# EAGLE design Sch (EAGLE 7.5.0)
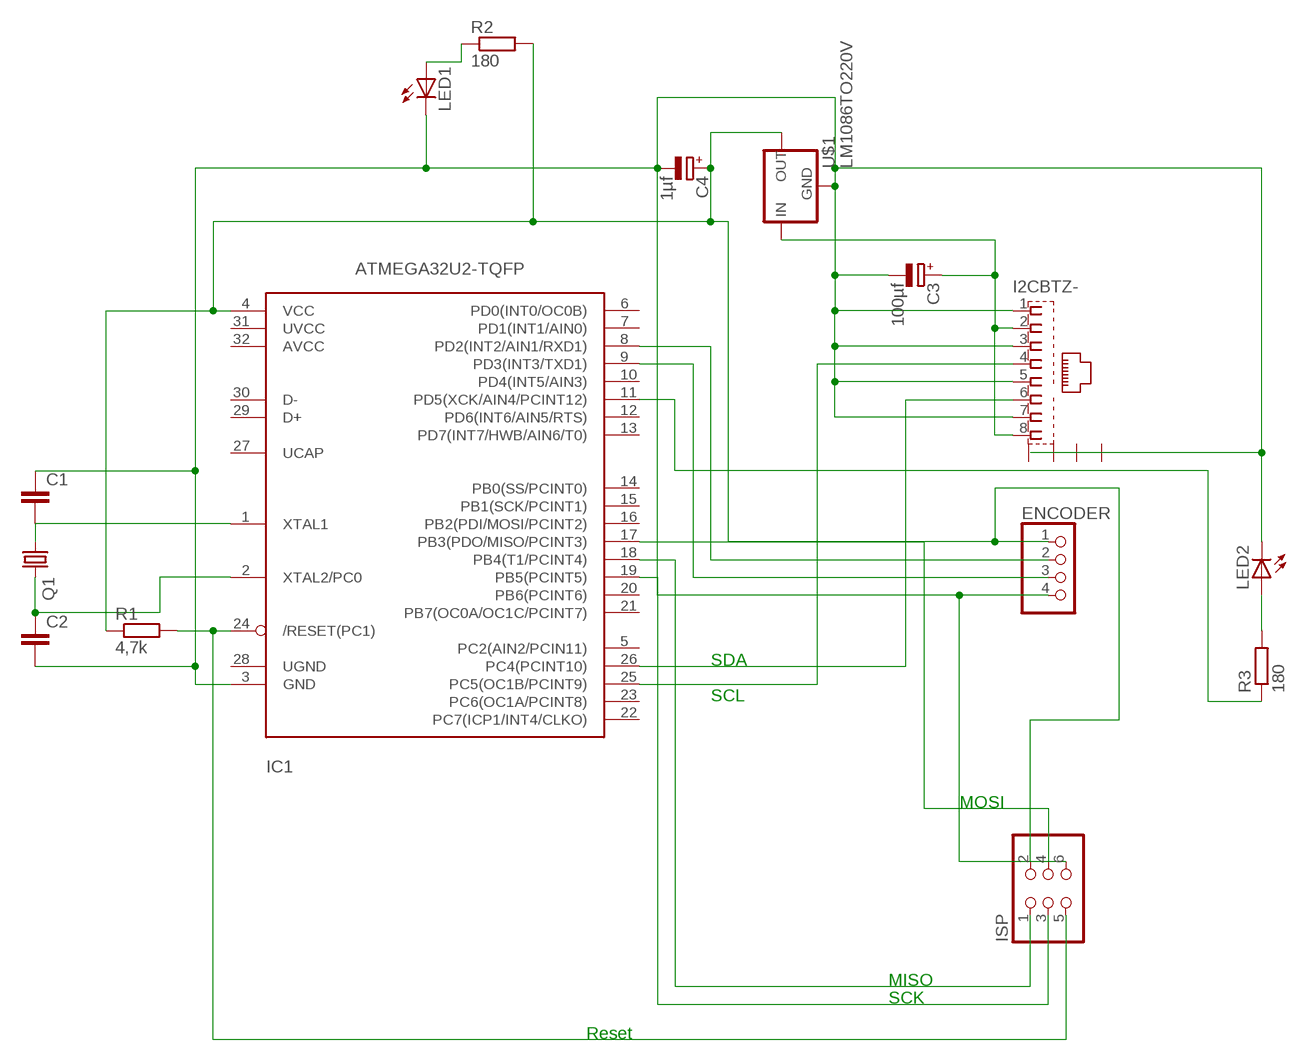
[diagram p0: schematic, sheet 1]

## Parts
C1  C-EU025-025X050  [C025-025X050]
C2  C-EU025-025X050  [C025-025X050]
C3  100µf  CPOL-EUE2.5-6  [E2,5-6]
C4  1µf  CPOL-EUE2.5-6  [E2,5-6]
ENCODER  PINHD-1X4  [1X04]
I2CBTZ  RJ45  [RJ45]
IC1  ATMEGA32U2-TQFP  [TQFP32-08]
ISP  PINHD-2X3  [2X03]
LED1  LED5MM  [LED5MM]
LED2  LED5MM  [LED5MM]
Q1  CRYSTALHC49S  [HC49/S]
R1  4,7k  R-EU_0204/7  [0204/7]
R2  180  R-EU_0204/7  [0204/7]
R3  180  R-EU_0204/7  [0204/7]
U$1  LM1086TO220V  [TO220S]

## Nets
N$1: LED2.A R3.2
N$2: IC1.24(/RESET(PC1)) ISP.5 R1.2
N$3: C4.+ ENCODER.1 IC1.4(VCC) ISP.2 R1.1 R2.2 U$1.2(OUT)
N$4: C3.+ I2CBTZ.2 I2CBTZ.8 U$1.3(IN)
N$5: C1.2 IC1.1(XTAL1) Q1.1
N$6: I2CBTZ.4 IC1.25(PC5(OC1B/PCINT9))
N$7: I2CBTZ.6 IC1.26(PC4(PCINT10))
N$8: C2.1 IC1.2(XTAL2/PC0) Q1.2
N$9: ENCODER.2 IC1.8(PD2(INT2/AIN1/RXD1))
N$10: ENCODER.3 IC1.9(PD3(INT3/TXD1))
N$11: IC1.18(PB4(T1/PCINT4)) ISP.1
N$12: C1.1 C2.2 C3.- C4.- ENCODER.4 I2CBTZ.1 I2CBTZ.3 I2CBTZ.5 I2CBTZ.7 IC1.3(GND) ISP.6 LED1.K(C) LED2.K(C) U$1.1(GND)
N$13: IC1.19(PB5(PCINT5)) ISP.3
N$14: IC1.17(PB3(PDO/MISO/PCINT3)) ISP.4
N$15: IC1.11(PD5(XCK/AIN4/PCINT12)) R3.1
N$16: LED1.A R2.1
Unconnected: I2CBTZ.G1 I2CBTZ.G2 I2CBTZ.G3 I2CBTZ.G4 IC1.5(PC2(AIN2/PCIN11)) IC1.6(PD0(INT0/OC0B)) IC1.7(PD1(INT1/AIN0)) IC1.10(PD4(INT5/AIN3)) IC1.12(PD6(INT6/AIN5/RTS)) IC1.13(PD7(INT7/HWB/AIN6/T0)) IC1.14(PB0(SS/PCINT0)) IC1.15(PB1(SCK/PCINT1)) IC1.16(PB2(PDI/MOSI/PCINT2)) IC1.20(PB6(PCINT6)) IC1.21(PB7(OC0A/OC1C/PCINT7)) IC1.22(PC7(ICP1/INT4/CLKO)) IC1.23(PC6(OC1A/PCINT8)) IC1.27(UCAP) IC1.28(UGND) IC1.29(D+) IC1.30(D-) IC1.31(UVCC) IC1.32(AVCC)

## Notes on the sheet
- SDA
- SCL
- MOSI
- MISO
- SCK
- Reset

## Library data of the parts
C1 C2 = rcl:C-EU: CAPACITOR, European symbol
C3 C4 = rcl:CPOL-EU: POLARIZED CAPACITOR, European symbol
ENCODER = pinhead:PINHD-1X4: PIN HEADER
I2CBTZ = con-appsys:RJ45: AMP connector
IC1 = adafruit:ATMEGA32U2: ATmega32u2 Pin compatible with the atmega8u2, atmega16u2 and atmega32u2 8, 16 or 32 K flash, 1K RAM, 512b EEPROM 8 bit and 16 bit timer (5 PWM total) UART, SPI (no I2C!) USB with 4 endpoints, LUFA compatible 22 I/O lines, analog comparator (no ADC!) Comes with DFU bootloader burned in!
ISP = pinhead:PINHD-2X3: PIN HEADER
LED1 LED2 = led:LED: LED OSRAM: - CHIPLED LG R971, LG N971, LY N971, LG Q971, LY Q971, LO R971, LY R971 LH N974, LH R974 LS Q976, LO Q976, LY Q976 LO Q996 - Hyper CHIPLED LW Q18S LB Q993, LB Q99A, LB R99A - SideLED LS A670, LO A670, LY A670, LG A670, LP A670 LB A673, LV A673, LT A673, LW A673 LH A674 LY A675 LS A676, LA A676, LO A676, LY A676, LW A676 LS A679, LY A679, LG A679 - Hyper Micro SIDELED® LS Y876, LA Y876, LO Y876, LY Y876 LT Y87S - SmartLED LW L88C, LW L88S LB L89C, LB L89S, LG L890 LS L89K, LO L89K, LY L89K LS L896, LA L896, LO L896, LY L896 - TOPLED LS T670, LO T670, LY T670, LG T670, LP T670 LSG T670, LSP T670, LSY T670, LOP T670, LYG T670 LG T671, LOG T671, LSG T671 LB T673, LV T673, LT T673, LW T673 LH T674 LS T676, LA T676, LO T676, LY T676, LB T676, LH T676, LSB T676, LW T676 LB T67C, LV T67C, LT T67C, LS T67K, LO T67K, LY T67K, LW E67C LS E67B, LA E67B, LO E67B, LY E67B, LB E67C, LV E67C, LT E67C LW T67C LS T679, LY T679, LG T679 LS T770, LO T770, LY T770, LG T770, LP T770 LB T773, LV T773, LT T773, LW T773 LH T774 LS E675, LA E675, LY E675, LS T675 LS T776, LA T776, LO T776, LY T776, LB T776 LHGB T686 LT T68C, LB T68C - Hyper Mini TOPLED® LB M676 - Mini TOPLED Santana® LG M470 LS M47K, LO M47K, LY M47K Source: http://www.osram.convergy.de LUXEON: - LUMILED® LXK2-PW12-R00, LXK2-PW12-S00, LXK2-PW14-U00, LXK2-PW14-V00 LXK2-PM12-R00, LXK2-PM12-S00, LXK2-PM14-U00 LXK2-PE12-Q00, LXK2-PE12-R00, LXK2-PE12-S00, LXK2-PE14-T00, LXK2-PE14-U00 LXK2-PB12-K00, LXK2-PB12-L00, LXK2-PB12-M00, LXK2-PB14-N00, LXK2-PB14-P00, LXK2-PB14-Q00 LXK2-PR12-L00, LXK2-PR12-M00, LXK2-PR14-Q00, LXK2-PR14-R00 LXK2-PD12-Q00, LXK2-PD12-R00, LXK2-PD12-S00 LXK2-PH12-R00, LXK2-PH12-S00 LXK2-PL12-P00, LXK2-PL12-Q00, LXK2-PL12-R00 Source: www.luxeon.com KINGBRIGHT: KA-3528ASYC Source: www.kingbright.com
Q1 = crystal:CRYSTAL: CRYSTAL; OC_FARNELL: 1667008; OC_NEWARK: unknown
R1-R3 = rcl:R-EU_: RESISTOR, European symbol
U$1 = v-reg-2:LM1086

## Board
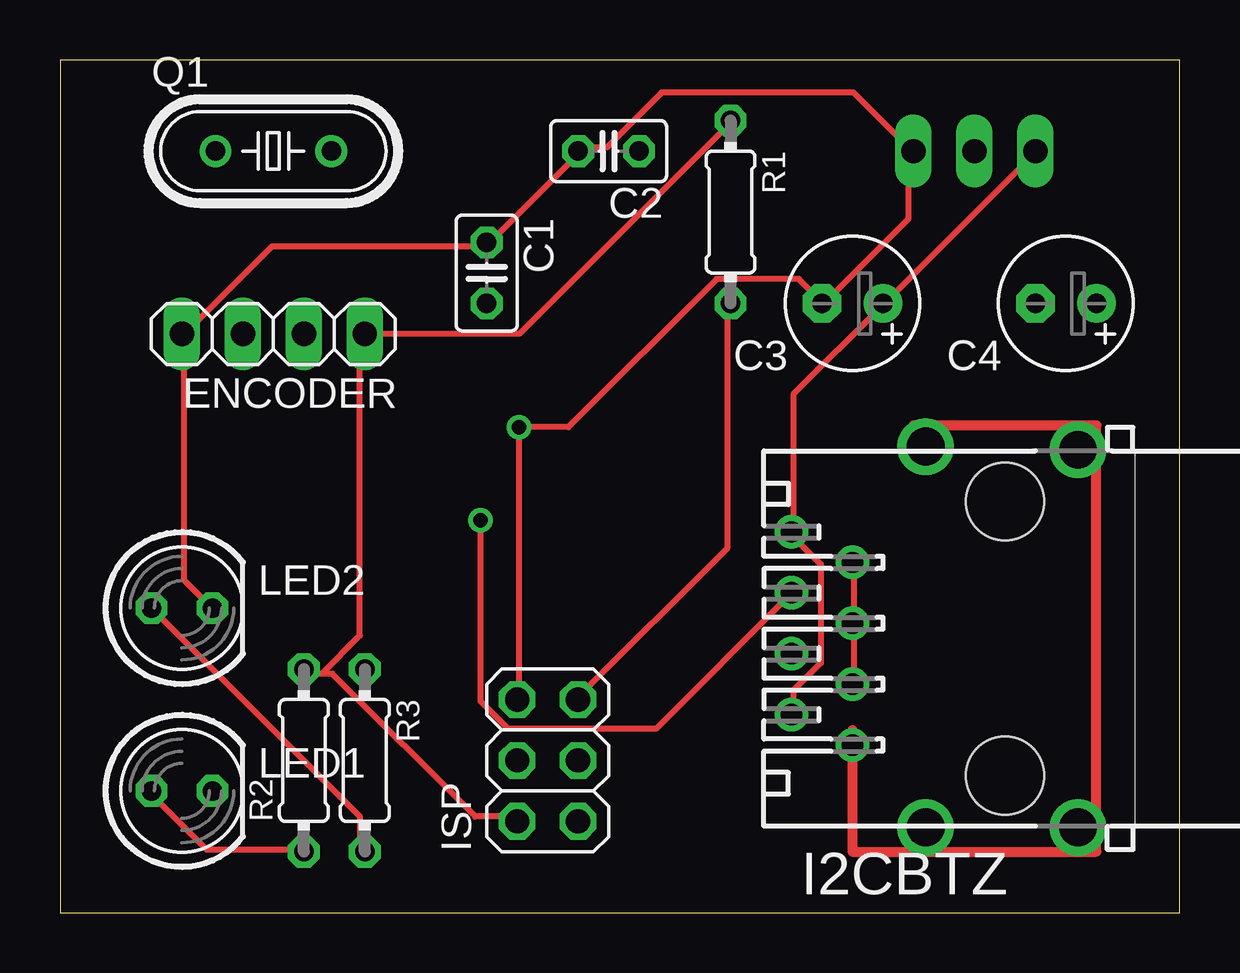
[diagram p1: board, top side]
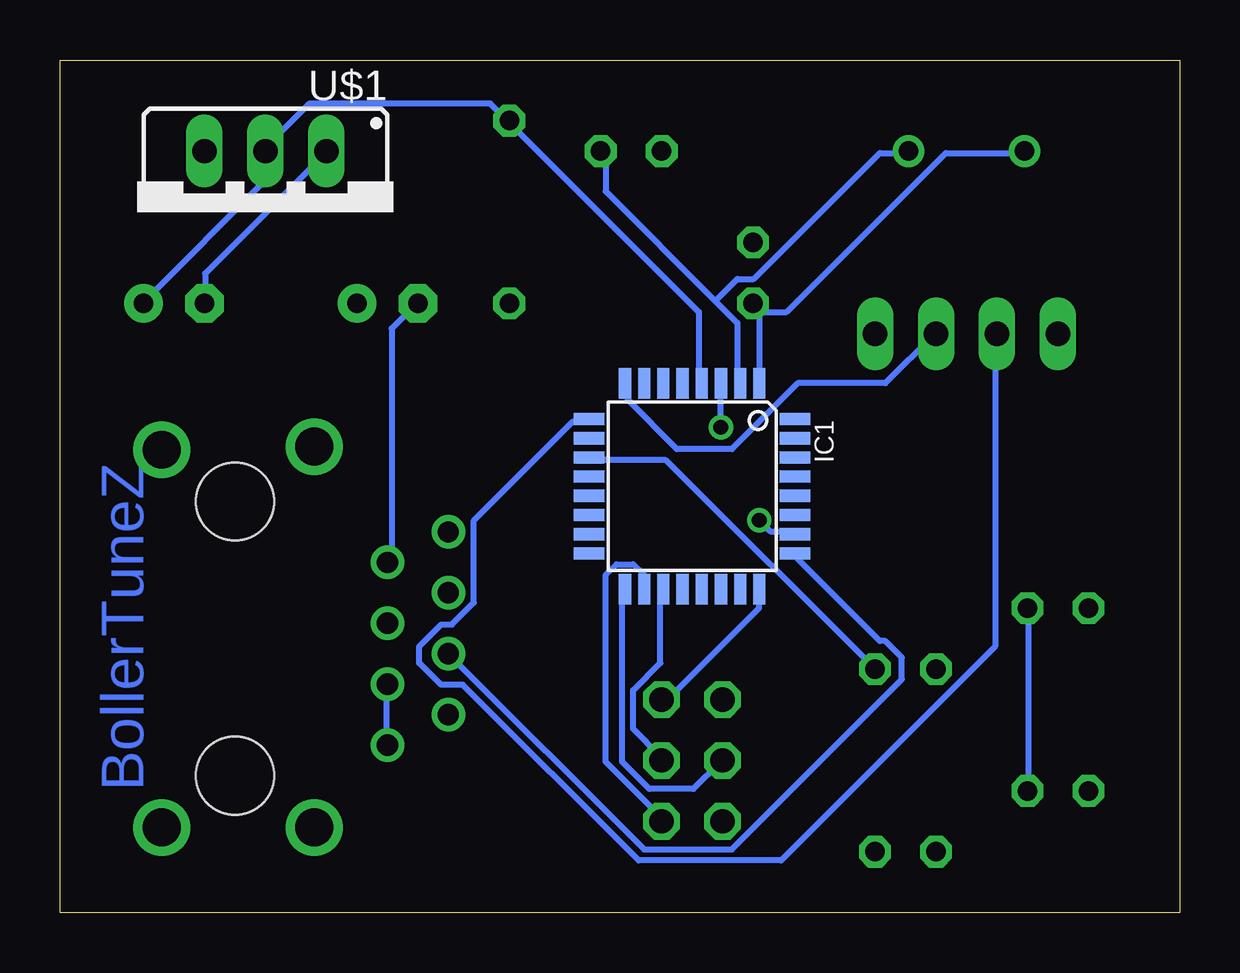
[diagram p2: board, bottom side, seen from below]

Size 46.66 x 35.55 mm. Coordinates in mm from the lower left corner, seen from the top.
Outline: 0,0 46.66,0 46.66,35.55 0,35.55 0,0
Copper layers (1*16): Top 0.035mm / dielectric 1.5mm / Bottom 0.035mm
Design rules "default": minimum track width 10mil, minimum drill 24mil, track to track 8mil, track to pad 8mil, pad to pad 8mil, via to via 8mil, smd to smd 8mil, copper to edge 40mil, drill to drill 8mil, minimum pad ring 10mil, minimum via ring 8mil, stop-mask expansion 4mil, vias tented up to drill 0mil, thermal gap 10mil

### Footprints (pad centres in the part's own frame; a part is rotated, then mirrored left to right if it is on the bottom)
C025-025X050 = drill 0.813 octagon: 1 -1.27,0; 2 1.27,0
E2,5-6 = drill 0.813 pad 1.6: + -1.27,0 | drill 0.813 pad 1.6 octagon: - 1.27,0
1X04 = drill 1.016 long: 1 -3.81,0; 2 -1.27,0; 3 1.27,0; 4 3.81,0
RJ45 = drill 0.889: 1 -4.445,6.35; 2 -3.175,8.89; 3 -1.905,6.35; 4 -0.635,8.89; 5 0.635,6.35; 6 1.905,8.89; 7 3.175,6.35; 8 4.445,8.89 | drill 1.575 pad 2.184: G1 -7.874,-3.048; G2 7.874,-3.048; G3 -7.874,3.302; G4 8.001,3.302 | hole 3.251: -5.715,0; 5.715,0
TQFP32-08 = smd 1.27 x 0.508: 1 -4.293,2.8; 2 -4.293,2; 3 -4.293,1.2; 4 -4.293,0.4; 5 -4.293,-0.4; 6 -4.293,-1.2; 7 -4.293,-2; 8 -4.293,-2.8; 17 4.293,-2.8; 18 4.293,-2; 19 4.293,-1.2; 20 4.293,-0.4; 21 4.293,0.4; 22 4.293,1.2; 23 4.293,2; 24 4.293,2.8 | smd 0.508 x 1.27: 9 -2.8,-4.293; 10 -2,-4.293; 11 -1.2,-4.293; 12 -0.4,-4.293; 13 0.4,-4.293; 14 1.2,-4.293; 15 2,-4.293; 16 2.8,-4.293; 25 2.8,4.293; 26 2,4.293; 27 1.2,4.293; 28 0.4,4.293; 29 -0.4,4.293; 30 -1.2,4.293; 31 -2,4.293; 32 -2.8,4.293
2X03 = drill 1.016 octagon: 1 -2.54,-1.27; 2 -2.54,1.27; 3 0,-1.27; 4 0,1.27; 5 2.54,-1.27; 6 2.54,1.27
LED5MM = drill 0.813 octagon: A -1.27,0; K 1.27,0
HC49/S = drill 0.813: 1 -2.413,0; 2 2.413,0
0204/7 = drill 0.813 octagon: 1 -3.81,0; 2 3.81,0
TO220S = drill 1.016 long: 1 -2.54,-2.54; 2 0,-2.54; 3 2.54,-2.54

### Placement (x,y rotation side)
C1  17.78,26.67 270 top
C2  22.86,31.75 180 top
C3  33.02,25.4 180 top
C4  41.91,25.4 180 top
ENCODER  8.89,24.13 180 top
I2CBTZ  39.37,11.43 90 top
IC1  20.32,17.78 270 bottom
ISP  20.32,6.35 90 top
LED1  5.08,5.08 0 top
LED2  5.08,12.7 0 top
Q1  8.89,31.75 0 top
R1  27.94,29.21 270 top
R2  10.16,6.35 90 top
R3  12.7,6.35 270 top
U$1  38.1,29.21 180 bottom

### Tracks (layer width: path | path; a pad name or v marks a point on that pad's centre or on a via)
N$1
  Top 0.254: LED2.A 12.5,4.01 12.5,2.64 R3.2
N$2
  Top 0.254: R1.2 27.81,25.27 27.81,15.21 21.64,9.04 ISP.5
  Bottom 0.254: IC1.24 17.53,13.39 17.53,12.7 21.41,8.81 ISP.5
N$3
  Top 0.254: 10.9,9.96 11.35,9.96 17.3,4.01 18.9,4.01 ISP.2 | 10.9,9.96 10.21,9.96 R2.2 | 10.9,9.96 12.5,11.56 12.5,24.13 ENCODER.1 19.13,24.13 27.81,32.82 R1.1
  Bottom 0.254: C4.+ 43.13,25.5 38.1,30.53 U$1.2 38.1,31.9 36.27,33.73 28.73,33.73 28.04,33.05 R1.1 27.81,32.82 20.04,25.04 20.04,22.07 IC1.4
N$4
  Top 0.254: I2CBTZ.2 30.56,8.36 30.56,9.27 31.7,10.41 31.7,14.53 30.56,15.67 I2CBTZ.8 30.56,15.9 30.56,21.61 34.21,25.27 C3.+ 34.44,25.5 40.61,31.67 U$1.3
N$5
  Bottom 0.254: 17.53,25.04 IC1.1 | 17.53,25.04 17.75,25.27 C1.2 17.53,25.04 | 17.53,25.04 16.38,25.04 9.75,31.67 6.55,31.67 Q1.1
N$6
  Bottom 0.254: I2CBTZ.4 22.33,2.64 18.67,2.64 11.58,9.73 11.58,10.64 12.27,11.33 12.5,11.33 15.93,14.76 IC1.25
N$7  (via drill 0.61)
  Top 0.254: v17.53,16.36 17.53,8.81 18.67,7.67 24.84,7.67 30.33,13.16 I2CBTZ.6
  Bottom 0.254: v17.53,16.36 17.07,15.9 16.15,15.9 IC1.26
N$8
  Bottom 0.254: 19.35,25.5 23.93,30.07 23.93,31.67 C2.1 | 19.35,25.5 18.44,24.59 18.44,22.07 IC1.2 | 19.35,25.5 18.44,26.42 17.75,26.42 12.5,31.67 11.35,31.67 Q1.2
N$9
  Bottom 0.254: IC1.8 23.01,22.07 23.01,21.39 20.95,19.33 18.67,19.33 15.93,22.07 12.27,22.07 10.21,24.13 ENCODER.2
N$10
  Bottom 0.254: IC1.9 24.61,20.47 25.3,20.47 29.41,16.36 29.41,12.93 30.33,12.01 30.78,12.01 31.7,11.1 31.7,10.41 30.78,9.5 29.87,9.5 22.55,2.18 16.61,2.18 7.7,11.1 7.7,24.13 ENCODER.3
N$11
  Bottom 0.254: IC1.18 22.33,13.61 22.33,14.07 22.78,14.53 23.47,14.53 23.93,14.07 23.93,6.3 21.64,4.01 ISP.1
N$12  (via drill 0.61)
  Top 0.254: 5.18,24.13 5.18,13.84 6.32,12.7 LED2.K | 5.18,24.13 8.84,27.79 17.75,27.79 C1.1 17.98,28.02 21.64,31.67 C2.2 21.64,31.9 22.78,31.9 25.07,34.19 33.07,34.19 35.36,31.9 U$1.1 35.36,31.67 35.36,28.93 31.93,25.5 C3.- 31.7,25.5 30.78,26.42 27.36,26.42 21.18,20.24 v19.13,20.24 19.13,9.04 ISP.6 | 5.18,24.13 ENCODER.4 | I2CBTZ.7 33.07,14.53 33.07,12.24 I2CBTZ.5 33.07,12.01 33.07,9.73 I2CBTZ.3
  Bottom 0.254: LED1.K 6.32,5.16 6.32,12.7 LED2.K | v19.13,20.24 IC1.3 | I2CBTZ.1 33.07,6.98 33.07,9.5 I2CBTZ.3 | C4.- 40.61,25.5 40.61,26.64 35.58,31.67 U$1.1 | I2CBTZ.7 32.84,14.76 32.84,24.36 31.93,25.27 C3.-
N$13
  Bottom 0.254: IC1.19 21.64,13.39 21.64,10.41 22.78,9.27 22.78,7.67 21.64,6.53 ISP.3
N$14
  Bottom 0.254: IC1.17 23.24,13.39 23.24,6.3 22.1,5.16 20.27,5.16 19.13,6.3 ISP.4
N$15
  Bottom 0.254: R3.1 21.41,18.87 24.61,18.87 IC1.11
N$16
  Top 0.254: R2.1 9.98,2.64 6.1,2.64 3.81,4.93 LED1.A
N$17
  Top 0.406: 33.02,7.62 33.02,2.54 43.18,2.54 43.18,20.32 35.56,20.32

### Text on the board
Bottom: BollerTuneZ